# EasyEDA schematic xtValveTimer.json
TITLE: Sheet_1; REV: 1.0; Date: 2022-04-13; Sheet: 1/1; Company: Your Company
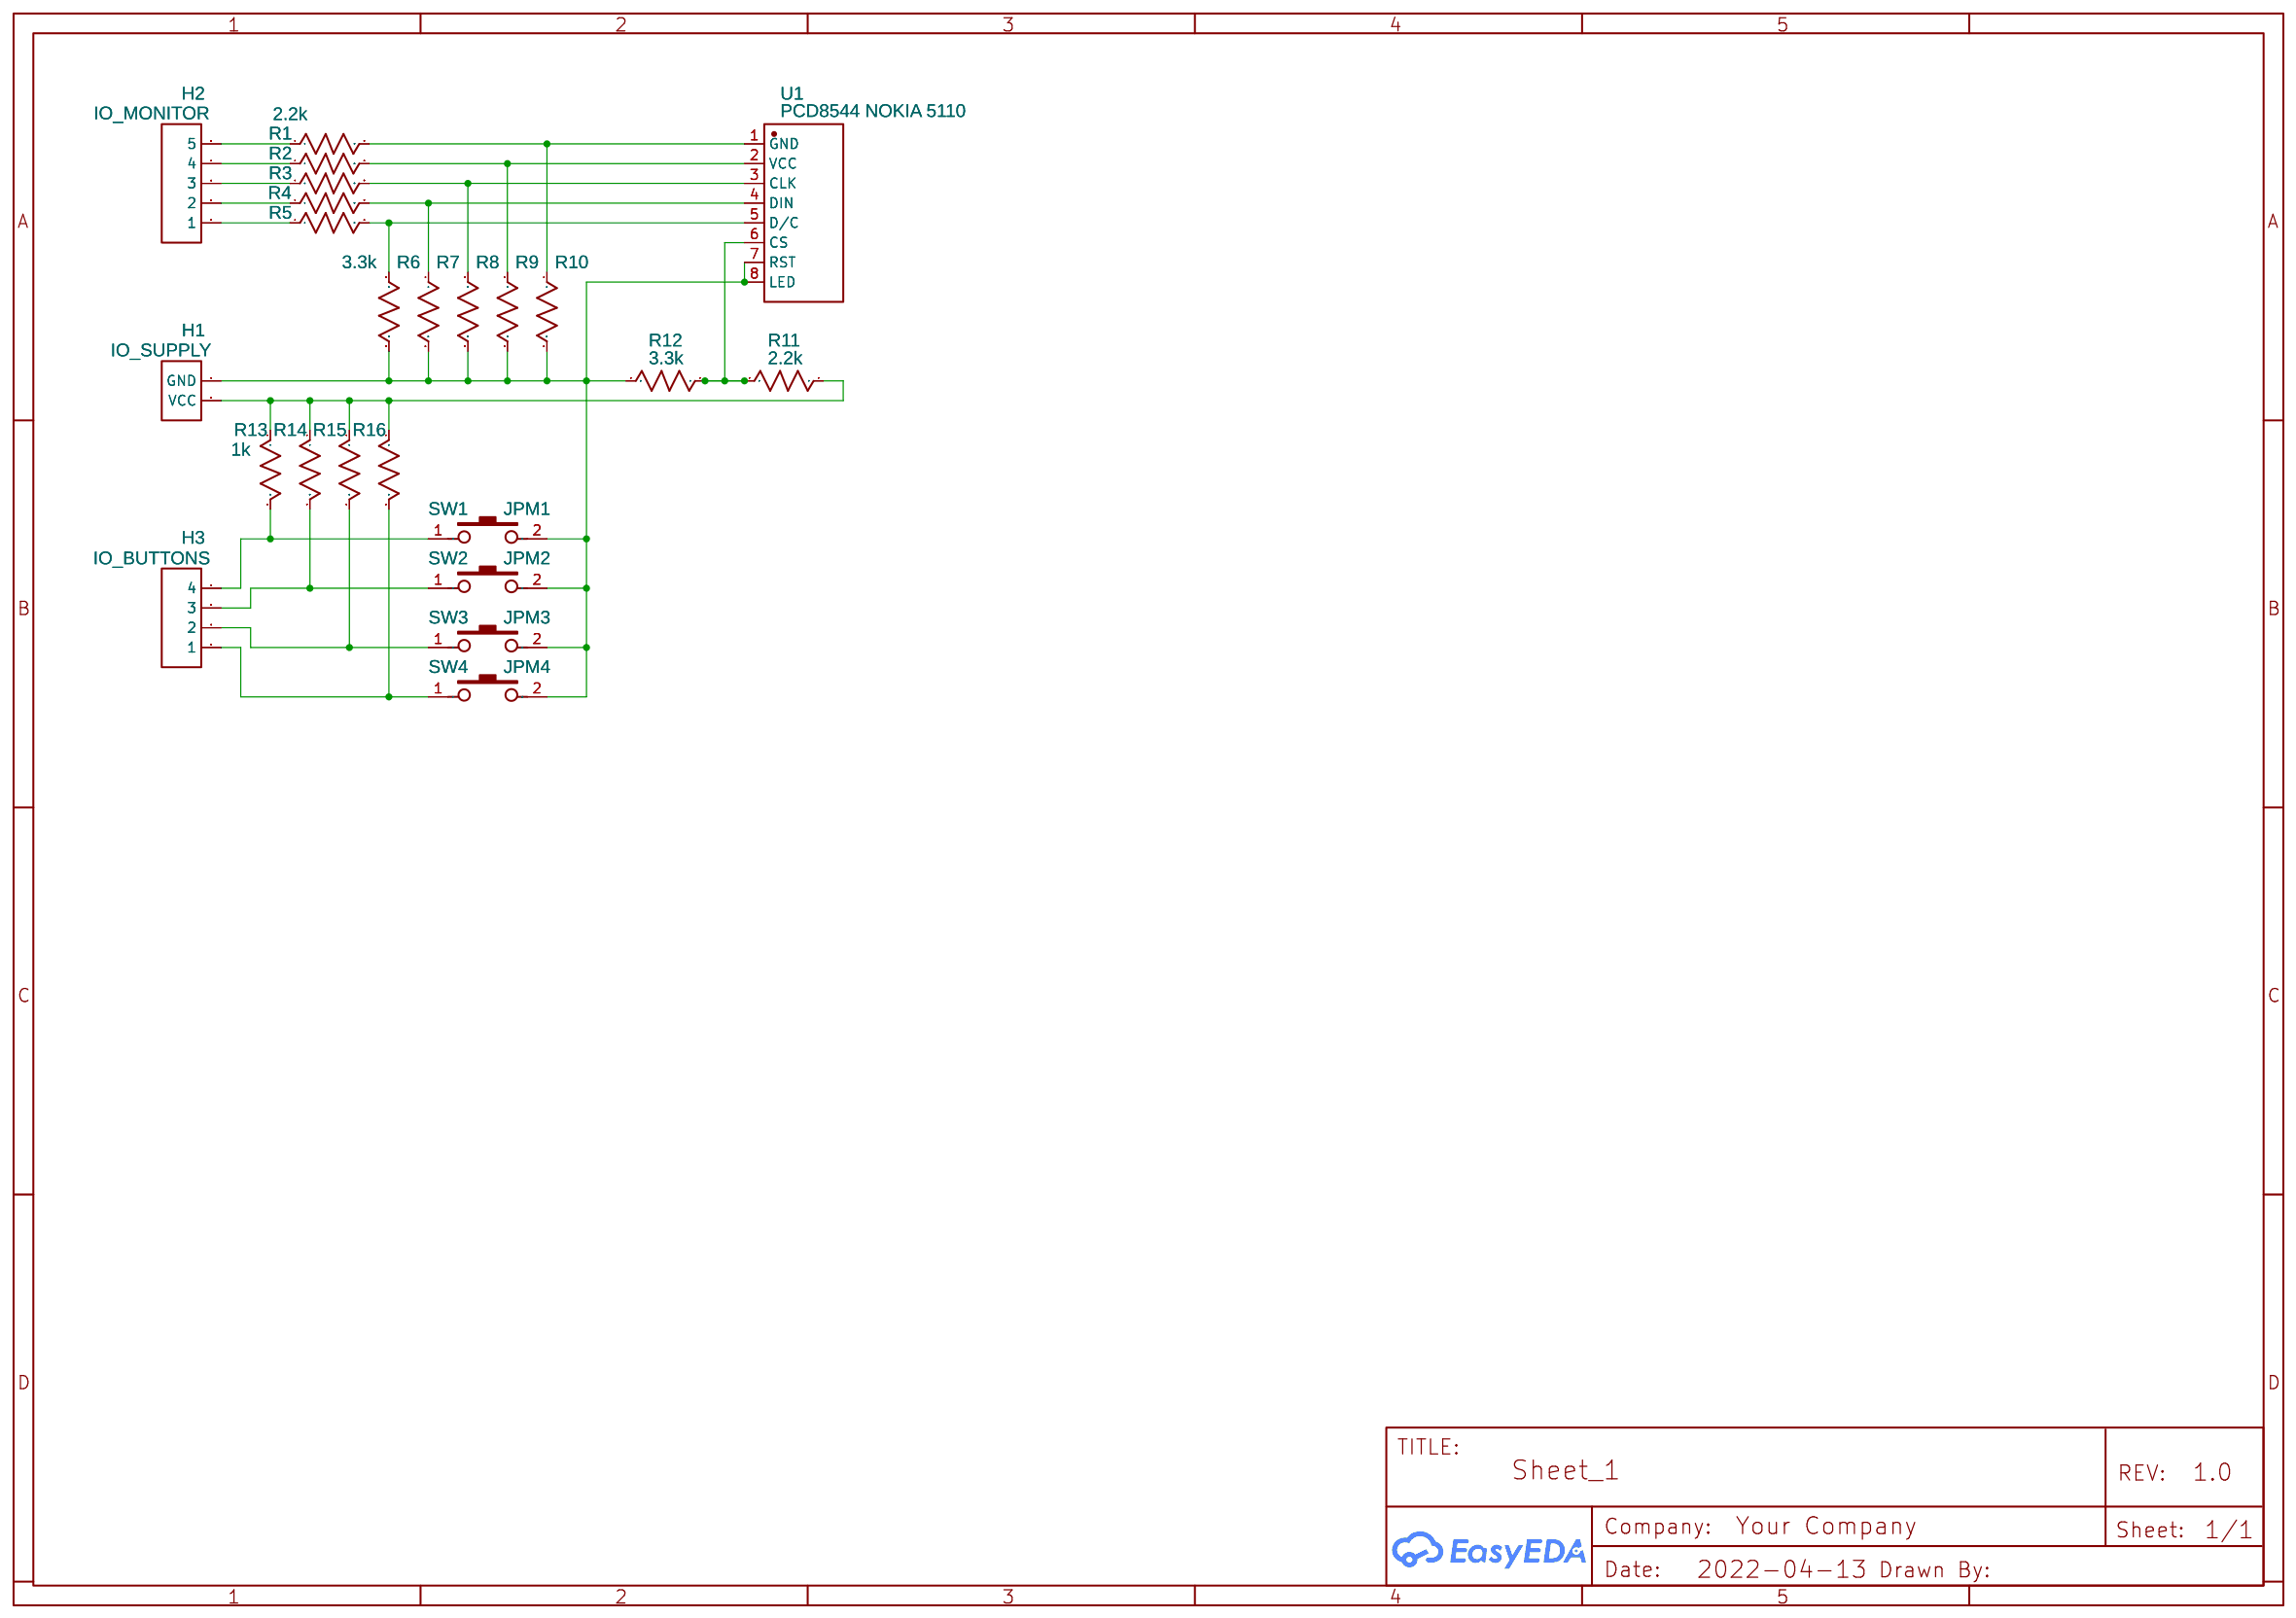
[diagram p0: schematic sheet]

## Parts
H1  IO_SUPPLY  [HDR-F-2.54_1X2]
H2  IO_MONITOR  [HDR-F-2.54_1X5]
H3  IO_BUTTONS  [HDR-F-2.54_1X4]
R1  2.2k  [R0603]
R2  1k  [R0603]
R3  1k  [R0603]
R4  1k  [R0603]
R5  1k  [R0603]
R6  3.3k  [R0603]
R7  3.3k  [R0603]
R8  3.3k  [R0603]
R9  3.3k  [R0603]
R10  3.3k  [R0603]
R11  2.2k  [R0603]
R12  3.3k  [R0603]
R13  1k  [R0603]
R14  1k  [R0603]
R15  1k  [R0603]
R16  1k  [R0603]
SW1  JPM1  [SW-SMD_SMK_JPM1040-XXXXFC]
SW2  JPM2  [SW-SMD_SMK_JPM1040-XXXXFC]
SW3  JPM3  [SW-SMD_SMK_JPM1040-XXXXFC]
SW4  JPM4  [SW-SMD_SMK_JPM1040-XXXXFC]
U1  PCD8544 NOKIA 5110  [PCD8544]

## Library data of the parts
H1 = HDR-F-2.54_1x2: Supplier Part: C49661; Supplier: LCSC; Contributor: LCEDA_Lib
H2 = HDR-F-2.54_1x5: Supplier Part: C50950; Supplier: LCSC; Contributor: LCEDA_Lib
H3 = HDR-F-2.54_1x4: Supplier Part: C225501; Supplier: LCSC; Contributor: LCEDA_Lib
R1-R16 = R_0603_US: Contributor: LCEDA_Lib
SW1-SW4 = JPM1040-2013FC: Supplier: LCSC; Supplier Part: C516061; Manufacturer: SMK; Contributor: LCSC; JLCPCB Part Class: Extended Part
U1 = PCD8544 NOKIA 5110: Contributor: Sergey18RU

## Nets
Net-(H1-1): H1.1(VCC) R11.1 R13.1 R14.1 R15.1 R16.1
Net-(H1-2): H1.2(GND) R6.2 R7.2 R8.2 R9.2 R10.2 R12.2 SW1.2 SW2.2 SW3.2 SW4.2 U1.7(RST) U1.8(LED)
Net-(H2-1): H2.1 R5.1
Net-(H2-2): H2.2 R4.1
Net-(H2-3): H2.3 R3.1
Net-(H2-4): H2.4 R2.1
Net-(H2-5): H2.5 R1.1
Net-(H3-1): H3.1 R16.2 SW4.1
Net-(H3-2): H3.2 R15.2 SW3.1
Net-(H3-3): H3.3 R14.2 SW2.1
Net-(H3-4): H3.4 R13.2 SW1.1
Net-(R1-2): R1.2 R10.1 U1.1(GND)
Net-(R2-2): R2.2 R9.1 U1.2(VCC)
Net-(R3-2): R3.2 R8.1 U1.3(CLK)
Net-(R4-2): R4.2 R7.1 U1.4(DIN)
Net-(R5-2): R5.2 R6.1 U1.5(D/C)
Net-(R11-2): R11.2 R12.1 U1.6(CS)
